# Altium schematic sheet microcontroller.SchDoc
size A4; SheetNumber: 7; SheetTotal: 7
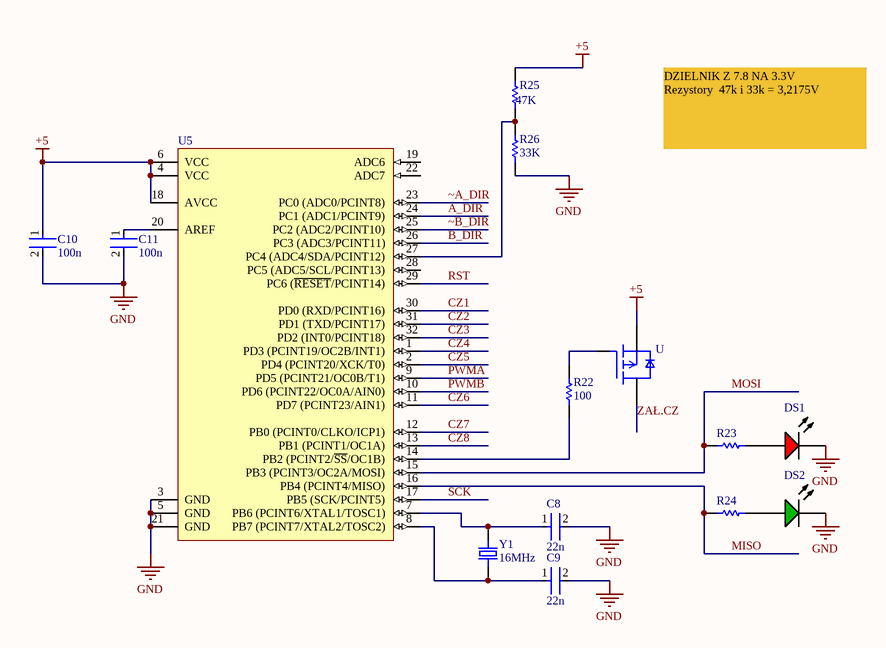
[diagram p0: microcontroller.SchDoc]

## Parts
C8  22n  [FP-C0805C-DN-MFG]
C9  22n  [FP-C0805C-DN-MFG]
C10  100n  [FP-0805-L_2_01_0_2-W_1_25-IPC_B]
C11  100n  [FP-0805-L_2_01_0_2-W_1_25-IPC_B]
DS1  HSMS-C190  [AVAG-HSMX-C190_V]  (value not drawn)
DS2  HSMG-C190  [AVAG-HSMX-C190_V]  (value not drawn)
R22  100  [RESC2013X50X30LL20T20]
R23  (no value)  [RESC2013X50X30LL20T20]
R24  (no value)  [RESC2013X50X30LL20T20]
R25  47K  [RESC2013X70X40ML20T20]
R26  33K  [RESC2013X60X40NL20T25]
U  (no value)  [SOT23-3]
U5  ATmega328P-AU  [32A_M]  (value not drawn)
Y1  16MHz  [XTAL_ECS-160-20-4X]

## Nets
+5: C10.1 R25.2 U.2(S) U5.4(VCC) U5.6(VCC) U5.18(AVCC)
GND: C8.2 C9.2 C10.2 C11.2 DS1.2(K) DS2.2(K) R26.1 U5.3(GND) U5.5(GND) U5.21(GND)
A_DIR: U5.24(PC1_(ADC1/PCINT9))
B_DIR: U5.26(PC3_(ADC3/PCINT11))
CZ1: U5.30(PD0_(RXD/PCINT16))
CZ2: U5.31(PD1_(TXD/PCINT17))
CZ3: U5.32(PD2_(INT0/PCINT18))
CZ4: U5.1(PD3_(PCINT19/OC2B/INT1))
CZ5: U5.2(PD4_(PCINT20/XCK/T0))
CZ6: U5.11(PD7_(PCINT23/AIN1))
CZ7: U5.12(PB0_(PCINT0/CLKO/ICP1))
CZ8: U5.13(PB1_(PCINT1/OC1A))
MISO: R24.1 U5.16(PB4_(PCINT4/MISO))
MOSI: R23.1 U5.15(PB3_(PCINT3/OC2A/MOSI))
PWMA: U5.9(PD5_(PCINT21/OC0B/T1))
PWMB: U5.10(PD6_(PCINT22/OC0A/AIN0))
RST: U5.29(PC6_(~{RESET}/PCINT14))
SCK: U5.17(PB5_(SCK/PCINT5))
ZAŁ.CZ: U.3(D)
~A_DIR: U5.23(PC0_(ADC0/PCINT8))
~B_DIR: U5.25(PC2_(ADC2/PCINT10))
NetC8_1: C8.1 U5.7(PB6_(PCINT6/XTAL1/TOSC1)) Y1.2
NetC9_1: C9.1 U5.8(PB7_(PCINT7/XTAL2/TOSC2)) Y1.1
NetC11_1: C11.1 U5.20(AREF)
NetDS1_1: DS1.1(A) R23.2
NetDS2_1: DS2.1(A) R24.2
NetR22_1: R22.1 U5.14(PB2_(PCINT2/~{SS}/OC1B))
NetR22_2: R22.2 U.1(G)
NetR25_1: R25.1 R26.2 U5.27(PC4_(ADC4/SDA/PCINT12))

Not connected (* = marked no-connect by the designer): U5 19(ADC6) 22(ADC7) 28(PC5_(ADC5/SCL/PCINT13))

## Notes on the sheet
- DZIELNIK Z 7.8 NA 3.3V
  Rezystory  47k i 33k = 3,2175V

## Library data of the parts
C8 C9 = CMP-2007-00338-2: CAP CER 0.022UF 50V X7R 0805; Manufacturer: KEMET; Manufacturer Part Number: C0805C223K5RACTU; Value: 22,000 pF; Material: Ceramic; Tolerance: 0.1; Temperature Coefficient: 30ppm/°C; Description: C0805 22,000 pF X7R 30ppm/°C 10.00% 50 V; Automotive: No; Package: C0805C-DN; RoHS: TRUE; Height: 0.88mm; Lead Free: Yes; Temperature Range Low: -55°C; Digikey Description: CAP CER 0.022UF 50V X7R 0805; ComponentLink2Description: Datasheet; Capacitance: 22,000 pF; Mouser Description: Capacitor; Ceramic; Cap; .022uF; Tol 10%; SMT; Vol-Rtg 50V; X7R; Tape and Reel; Device Class L3: Ceramic Capacitors; Category: Cap; Voltage Rating: 50 V; Temperature Characteristic: X7R; Ipc Land Pattern Name: CAPC200125X78; Octopart: https://octopart.com/c0805c223k5ractu-kemet-145968; Device Class L1: Passive Components; Temperature: -55°C to +125°C; ComponentLink2URL: https://content.kemet.com/datasheets/KEM_C1003_C0G_SMD.pdf; Temperature Range High: +125°C; Device Class L2: Capacitors
C10 C11 = CMP-2007-04174-2: General Purpose Ceramic Capacitor, 0805, 100nF, 10%, X7R, 15%, 100V; Packaging: Tape and Reel; Min Operating Temperature: -55°C; Dielectric Material: Ceramic; Height: 1.4mm; Voltage Rating: 100V; Termination: SMD/SMT; Case Code (Imperial): 0805; Case Code (Metric): 2012; Case/Package: 0805; Construction: Flat; Radiation Hardening: No; Series: -; Dielectric: X7R; Package Quantity: 2000; Mount: Surface Mount; Capacitance: 100nF; Contact Plating: Tin; Voltage: 100V; Lead Free: Lead Free; Depth: 1.25mm; RoHS Compliant: Yes; Number of Pins: 2; Max Operating Temperature: 125°C; Length: 2.01mm; Voltage Rating (DC): 100V; Thickness: 0.055inch; REACH SVHC: No SVHC; Width: 0.049inch; Tolerance: 10%
DS1 = CMP-2000-06427-1: LED Uni-Color Red, 52 mW, 20 mA, -40 to 85 degC, 2-Pin SMD, RoHS, Tape and Reel; Manufacturer: Avago; Reverse Voltage: 5V; Viewing Angle: 170deg; High Brightness: No; Lens Type: ColorlessDiffused; DELETED: Compliant; Product Height (mm): 0.8mm; Dominant Wave Length: 626nm; Number of  Elements: 1; Chip Material: GaP; Lum Intensity: 10mcd; Product Length (mm): 1.6mm; Forward Voltage: 2.6V; Power Dissipation: 52W; Shape Type: Rectangular; Forward Current: 25mA; Peak Wavelength: 630nm; Test Current (It): 20mA; Main Category: ChipLED; Lens Dimensions: 1x0.8x0.5mm; Pin Count: 2; Package Reference: HSMX-C190; Mounting Technology: SurfaceMount; Mounting: SurfaceMount; Datasheet URL: http://docs.avagotech.com/docs/AV02-0551EN; Package Type: ChipLed; Operating Temperature Classification: Industrial; Datasheet Version: 03/2012; Operating Temp Range: -40Cto85C; Emitting Color: Red; Rad Hardened: No; Manufacturer URL: http://www.avagotech.com/; Luminous Intensity: 10mcd; Package Description: 2-Pin Surface Mount Device, Body 1.6 x 0.8 mm, Height 0.9 mm; Type: Uni-Color; Packaging: TapeandReel; Product Depth (mm): 0.8mm
DS2 = CMP-1744-00002-1: Chip LED, Green, 2.2 V, -40 to 85 degC, 2-Pin SMD, RoHS, Tape and Reel; Frequency: 400 KHz; Max Supply Voltage: 5.5 V; Access Time: 3500 ns; Clock Frequency: 100 KHz; Case\Package: SOIC; Density: 32 kb; Nominal Supply Current: 2 mA; Interface: Serial; Min Supply Voltage: 1.7 V; Packaging: Tape and Reel; PackageReference: HSMX-C190; ComponentLink2URL: http://docs.avagotech.com/docs/AV02-0551EN; RoHSCompliant: true; Pins: 8; REACH SVHC: No SVHC; Max Operating Temperature: 85 degC; Width: 4 mm; Radiation Hardening: No; Package Quantity: 3000; ComponentLink3Description: Package Specification; ComponentLink1Description: Manufacturer URL; Min Operating Temperature: -40 degC; PackageDescription: 2-Pin Surface Mount Device, Body 1.6 x 0.8 mm, Height 0.9 mm; Max Clock Frequency: 100 KHz; Height: 1.5 mm; ComponentLink1URL: http://www.avagotech.com/; DatasheetVersion: Mar-12; ComponentLink2Description: Datasheet; Mount: Surface Mount; Length: 5 mm; ComponentLink3URL: http://www.fairchildsemi.com/dwg/MA/MA03D.pdf
R22 = CMP-2001-04901-1: Manufacturer: Vishay Dale; Part Number: CRCW0805100RFKEA
R23 R24 = CMP-2001-03932-1: Manufacturer: Vishay Dale; Part Number: CRCW0805470RFKEA
R25 = CMP-2001-00551-1: Manufacturer: Panasonic; Part Number: ERJ6ENF4702V
R26 = CMP-2001-00630-1: Manufacturer: Panasonic; Part Number: ERA6AEB333V
U = AO3401: P-Channel 30V 4A (Ta) 1.4W (Ta) Surface Mount SOT-23-3L; MF: Alpha & Omega Semiconductor; Price: None; SnapEDA_Link: https://www.snapeda.com/parts/AO3401/Alpha%20&%20Omega%20Semiconductor/view-part/4795619/?ref=snap; Arrow_Electronics-Purchase-URL: https://snapeda.com/shop?store=Arrow+Electronics&id=4795619; Availability: Warning; MP: AO3401; Value: *; Package: SOT-23-3 Alpha &amp; Omega Semiconductor
U5 = CMP-0095-00269-2: 8-bit AVR Microcontroller, 32KB Flash, 1KB EEPROM, 2KB SRAM, 32-pin TQFP, Industrial Grade (-40°C to 85°C); PackageDescription: 32-Lead, 7x7x1.0 mm Body, 0.8mm Lead Pitch, Thin Profile Plastic Quad Flat Package (TQFP); DatasheetVersion: revD, May-2011; RevisionNote: DatasheetVersion & PackageVersion updated. URLs added.; ComponentLink1URL: http://www.atmel.com/; ComponentLink2Description: ATmega48A/48PA/88A/88PA/168A/168PA/328/328P Datasheet; Code_JEDEC: MS-026-ABA; ComponentLink1Description: Manufacturer URL; PackageReference: 32A; ComponentLink3Description: ATmega48A/48PA/88A/88PA/168A/168PA/328/328P Summary; ComponentLink2URL: http://www.atmel.com/dyn/resources/prod_documents/doc8271.pdf; PackageVersion: revC, Oct-2010; ComponentLink3URL: http://www.atmel.com/dyn/resources/prod_documents/8271S.pdf
Y1 = ECS-121-S-4X_12.096: CRYSTAL T/H; MP: ECS-121-S-4X 12.096; Package: None; Price: None; Value: *; Availability: Unavailable